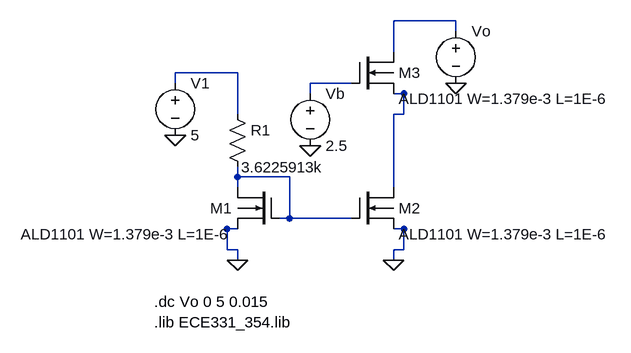
[diagram p0: schematic nmos_cascode_current_mirror_dc_out_swing.asc]
nmos_cascode_current_mirror_dc_out_swing.asc, the LTspice schematic file:
Version 4
SHEET 1 880 680
WIRE 416 -96 320 -96
WIRE 416 -80 416 -96
WIRE 320 -48 320 -96
WIRE 80 -16 -16 -16
WIRE -16 0 -16 -16
WIRE 256 0 192 0
WIRE 192 16 192 0
WIRE 336 16 320 16
WIRE 80 48 80 -16
WIRE 336 48 336 16
WIRE 336 48 320 48
WIRE 80 144 80 128
WIRE 160 144 80 144
WIRE 80 160 80 144
WIRE 320 160 320 48
WIRE 160 208 160 144
WIRE 160 208 144 208
WIRE 256 208 160 208
WIRE 80 224 64 224
WIRE 336 224 320 224
WIRE 64 256 64 224
WIRE 80 256 64 256
WIRE 336 256 336 224
WIRE 336 256 320 256
WIRE 80 272 80 256
WIRE 320 272 320 256
FLAG -16 80 0
FLAG 192 96 0
FLAG 416 0 0
FLAG 320 272 0
FLAG 80 272 0
SYMBOL ECE331\\ALD1101 144 160 M0
SYMATTR InstName M1
SYMBOL ECE331\\ALD1101 256 160 R0
SYMATTR InstName M2
SYMBOL ECE331\\ALD1101 256 -48 R0
SYMATTR InstName M3
SYMBOL res 64 32 R0
WINDOW 3 22 97 Left 2
SYMATTR InstName R1
SYMATTR Value 3.6225913k
SYMBOL voltage -16 -16 R0
WINDOW 123 0 0 Left 0
WINDOW 39 0 0 Left 0
SYMATTR InstName V1
SYMATTR Value 5
SYMBOL voltage 192 0 R0
WINDOW 123 0 0 Left 0
WINDOW 39 0 0 Left 0
SYMATTR InstName Vb
SYMATTR Value 2.5
SYMBOL voltage 416 -96 R0
SYMATTR InstName Vo
SYMATTR Value ""
TEXT -48 336 Left 2 !.dc Vo 0 5 0.015
TEXT -48 368 Left 2 !.lib ECE331_354.lib

The netlist it stands for:
* nmos_cascode_current_mirror_dc_out_swing.asc
M1 N005 N005 0 0 ALD1101 W=1.379e-3 L=1E-6
M2 N004 N005 0 0 ALD1101 W=1.379e-3 L=1E-6
M3 N001 N003 N004 N004 ALD1101 W=1.379e-3 L=1E-6
R1 N002 N005 3.6225913k
V1 N002 0 5
Vb N003 0 2.5
Vo N001 0
.model NMOS NMOS
.model PMOS PMOS
.lib standard.mos
.dc Vo 0 5 0.015
.lib ECE331_354.lib
.backanno
.end

* Results of the author's LTspice run, read from the files saved beside the schematic
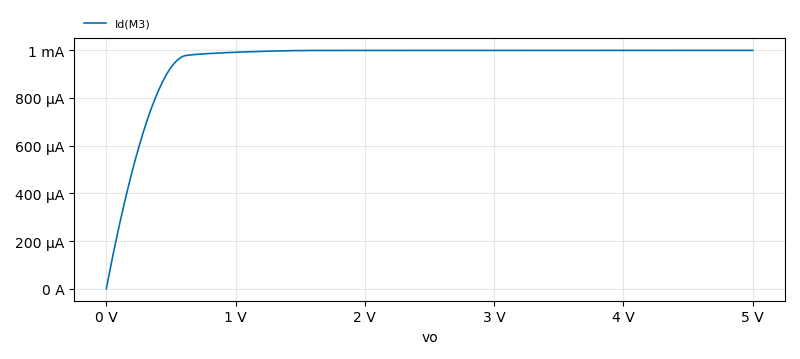
[diagram p1: DC transfer characteristic of nmos_cascode_current_mirror_dc_out_swing.asc, plotted from the saved traces]
* DC transfer characteristic, 1 run:
*   Id(M3): 0.003132 fA at vo=0 V, 998.5 µA at vo=5 V, min 0.003132 fA, max 998.5 µA